# EasyEDA Pro project 2025智能物流搬运_PCB_XAUT_20250927.eprj, schematic Schematic1_1
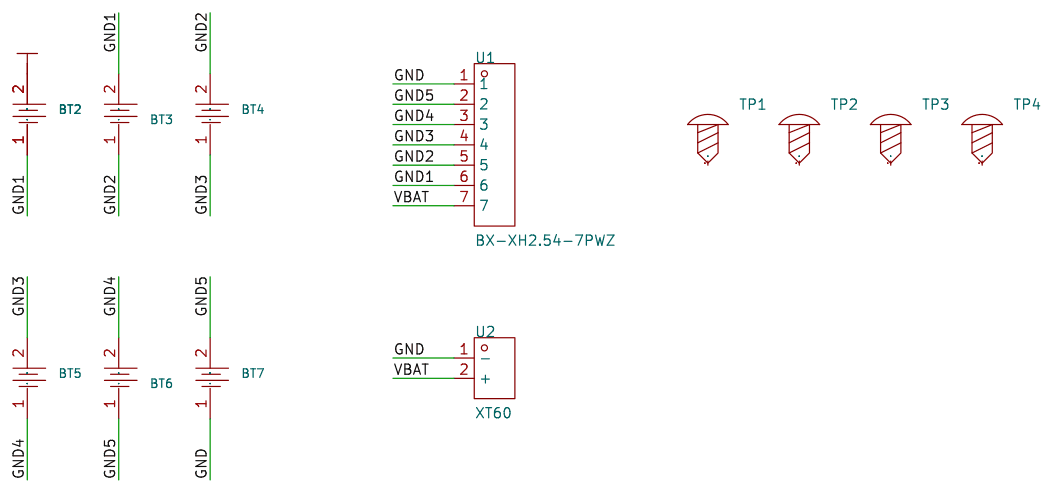
[diagram p7: schematic sheet]

## Parts
BT2  BH-18650-B1BA002  [BATTERY-SMD_18650-1S-L77.1-W20.7-1]
BT3  BH-18650-B1BA002  [BATTERY-SMD_18650-1S-L77.1-W20.7-1]
BT4  BH-18650-B1BA002  [BATTERY-SMD_18650-1S-L77.1-W20.7-1]
BT5  BH-18650-B1BA002  [BATTERY-SMD_18650-1S-L77.1-W20.7-1]
BT6  BH-18650-B1BA002  [BATTERY-SMD_18650-1S-L77.1-W20.7-1]
BT7  BH-18650-B1BA002  [BATTERY-SMD_18650-1S-L77.1-W20.7-1]
TP1  -  [M3螺丝]
TP2  -  [M3螺丝]
TP3  -  [M3螺丝]
TP4  -  [M3螺丝]
U1  BX-XH2.54-7PWZ  [CONN-TH_7P-P2.50_BX-XH2.54-7PWZ]
U2  XT60  [CONN-TH_XT60]

## Library data of the parts
BT2-BT7 = BH-18650-B1BA002: 连接器类型:电池盒;适用电池规格:18650;; Supplier: LCSC; Supplier Part: C2988620; Manufacturer: MYOUNG(美阳); JLCPCB Part Class: 扩展库; LCSC Part Name: 电池盒 适用电池:18650; Supplier Footprint: SMD; Datasheet: https://atta.szlcsc.com/upload/public/pdf/source/20220402/870DB99AB50CA0DF8D51CF7C86A51FAB.pdf; Connector Type: 电池盒; Battery Type: 18650
TP1-TP4 = M3螺丝: Supplier Footprint: 插件
U1 = BX-XH2.54-7PWZ: 插针结构:1x7P;间距:2.54mm;安装方式:弯插;参考系列:XH;总PIN数:7P;排数:1;每排PIN数:7;行距:-;额定电流:3A;触头材质:黄铜;触头镀层:锡;工作温度范围:-25℃~+85℃;; Supplier Part: C18077847; Manufacturer: Bossie(博锡); Supplier Footprint: 弯插,P=2.54mm; JLCPCB Part Class: 扩展库; Datasheet: https://atta.szlcsc.com/upload/public/pdf/source/20231017/CE814786BF516A2FCED5735AE699343F.pdf; Supplier: LCSC; Pins Structure: 1x7P; Pitch: 2.54mm; Mounting Style: 弯插; Reference Series: XH; Number of Pins: 7P; Number of Rows: 1; Number of PINs Per Row: 7; Current Rating (Max): 3A; Contact Material: 黄铜; Contact Plating: 锡; Operating Temperature Range: -25℃~+85℃
U2 = XT60: 类别:-;类型1:-;; LCSC Part Name: AMASS(艾迈斯) XT60模型插头 3.5mm镀金香蕉头公头（电调端）XT60-M; Supplier Part: C98733; Manufacturer: AMASS(艾迈斯); JLCPCB Part Class: 扩展库; Datasheet: https://atta.szlcsc.com/upload/public/pdf/source/20170606/1496716524919.pdf; Supplier: LCSC; Brand: 艾迈斯; Type: 香蕉头; Colour: 黄色; InterfaceType: 公头; specifications: 3.5mm

## Nets
GND: BT7.1 U1.1 U2.1(-)
GND1: BT2.1 BT3.2 U1.6
GND2: BT3.1 BT4.2 U1.5
GND3: BT4.1 BT5.2 U1.4
GND4: BT5.1 BT6.2 U1.3
GND5: BT6.1 BT7.2 U1.2
VBAT: BT2.2 U1.7 U2.2(+)

Not connected (* = marked no-connect by the designer): TP1 1; TP2 1; TP3 1; TP4 1
